# Altium schematic sheet 105358-3SC001-01-A_IO_BRD.SchDoc: I/O Board
size 420 x 297 mm; DrawnBy: JeSa , KaKa; Organization: Hotswap Norden AB; Address1: Knarrarnäsgatan 7; Address2: SE-164 40 Kista; Address3: Sweden; DocumentNumber: 105358-3SC001-01; SheetNumber: 5; SheetTotal: 5; PageSetup: Record=PageOptions|CenterHorizontal=True|CenterVertical=True|PrintScale=0.96|XCorrection=1.00|YCorrection=1.00|PrintKind=0|BorderSize=5000000|LeftOffset=0|BottomOffset=0|Orientation=2|PaperLength=1000|PaperWidth=1000|Scale=100|PaperSource=7|PrintQuality=-4|MediaType=1|DitherType=10|PaperKind=A3|PrintScaleMode=1
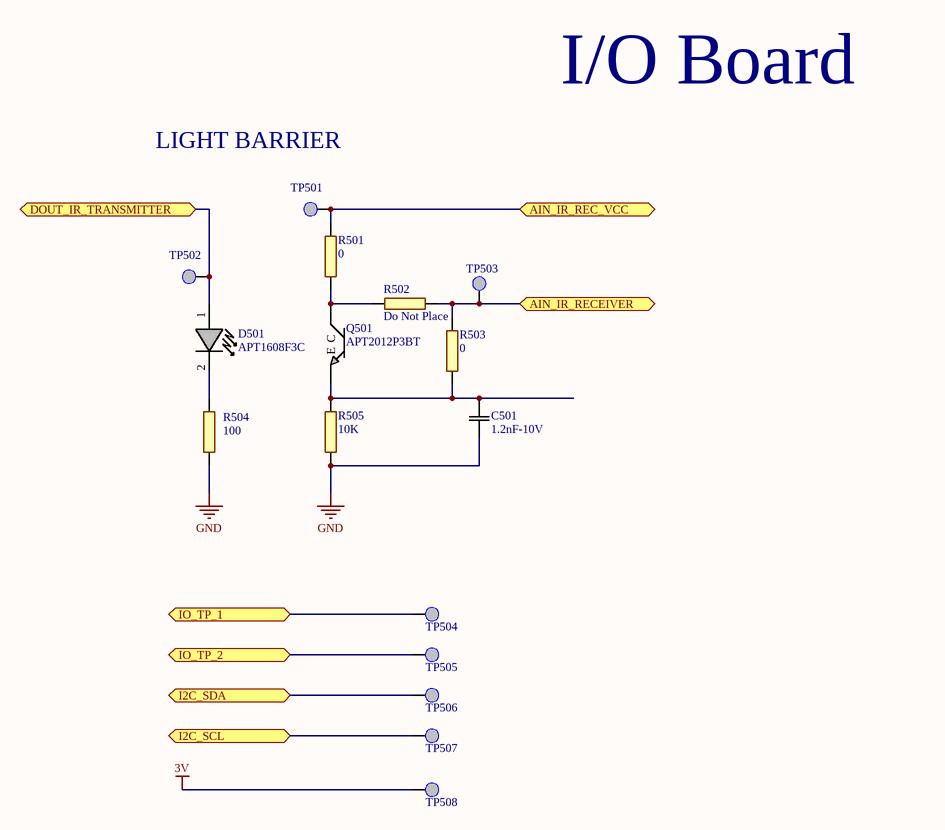
[diagram p0: 105358-3SC001-01-A_IO_BRD.SchDoc]

## Parts
C501  1.2nF-10V  [0402C_HIGH_DENSITY]
D501  APT1608F3C  [APT1608F3C]
Q501  APT2012P3BT  [APT2012P3BT]
R501  0  [0402R-GENERIC]
R502  Do Not Place  [0402R-GENERIC]
R503  0  [0402R-GENERIC]
R504  100  [0402R-GENERIC]
R505  10K  [0402R-GENERIC]
TP501  TEST POINT  [PAD TEST POINT]  (value not drawn)  (no BOM)
TP502  TEST POINT  [PAD TEST POINT]  (value not drawn)  (no BOM)
TP503  TEST POINT  [PAD TEST POINT]  (value not drawn)  (no BOM)
TP504  TEST POINT  [PAD TEST POINT]  (value not drawn)  (no BOM)
TP505  TEST POINT  [PAD TEST POINT]  (value not drawn)  (no BOM)
TP506  TEST POINT  [PAD TEST POINT]  (value not drawn)  (no BOM)
TP507  TEST POINT  [PAD TEST POINT]  (value not drawn)  (no BOM)
TP508  TEST POINT  [PAD TEST POINT]  (value not drawn)  (no BOM)

## Ports
AIN_IR_REC_VCC, AIN_IR_RECEIVER, DOUT_IR_TRANSMITTER, I2C_SCL, I2C_SDA, IO_TP_1, IO_TP_2

## Nets
3V: TP508.1(Test_Point)
GND: C501.1 R504.2 R505.2
AIN_IR_REC_VCC: R501.1 TP501.1(Test_Point) ; port AIN_IR_REC_VCC
AIN_IR_RECEIVER: R502.2 R503.1 TP503.1(Test_Point) ; port AIN_IR_RECEIVER
DOUT_IR_TRANSMITTER: D501.1(A) TP502.1(Test_Point) ; port DOUT_IR_TRANSMITTER
I2C_SCL: TP507.1(Test_Point) ; port I2C_SCL
I2C_SDA: TP506.1(Test_Point) ; port I2C_SDA
IO_TP_1: TP504.1(Test_Point) ; port IO_TP_1
IO_TP_2: TP505.1(Test_Point) ; port IO_TP_2
NetC501_2: C501.2 Q501.1(E) R503.2 R505.1
NetD501_2: D501.2(K) R504.1
NetQ501_2: Q501.2(C) R501.2 R502.1

## Notes on the sheet
- I/O Board
- LIGHT BARRIER
- Title
- Customer, project
- Drawn By
- Board
- Size
- Document Number
- Sheet
- of
- Last modified
- Rev
- Build
- A3

## Library data of the parts
C501 = 0402C-1.2nF-10V: 1.2nF ±10% 10V U2J Ceramic Capacitor 0402; Manufacturer Part Number: GRM1557U1A122JA01D; Manufacturer: Murata Electronics North America; Tolerance: 5%; Capacitance: 1.2nF; Digi-Key Part Number: 490-6272-1-ND; PackageReference: 0402; Temperature Coefficient: U2J; Voltage - Rated: 10V
D501 = APT1608F3C: 0603 INFRARED DIODE; Manufacturer: Kingbright; Wavelength: 940nm; Type: Infrared (IR); Current - DC Forward (If) (Max): 50mA; Radiant Intensity (Ie) Min @ If: 1.2mW/sr @ 20mA; Voltage - Forward (Vf) (Typ): 1.2V; Viewing Angle: 120°; Supplier 1: Digi-Key; Supplier Part Number 1: 754-1433-1-ND; Manufacturer Part Number: APT1608F3C; PackageReference: 0603; Mounting Type: Surface Mount; Operating Temperature: -40°C ~ 85°C (TA); ComponentLink1Description: Datasheet; ComponentLink1URL: http://www.kingbrightusa.com/images/catalog/SPEC/APT1608F3C.pdf; Digi-Key Part Number: 754-1433-1-ND
Q501 = APT2012P3BT: 0805 PHOTOTRANSISTOR; Manufacturer: Kingbright; Voltage - Collector Emitter Breakdown (Max): 30V; Current - Collector (Ic) (Max): 1mA; Current - Dark (Id) (Max): 100nA; Power - Max: 100mW; Supplier 1: Digi-Key; Supplier Part Number 1: 754-1436-1-ND; ComponentLink1Description: Datasheet; ComponentLink1URL: https://www.kingbrightusa.com/images/catalog/spec/APT2012P3BT.pdf; Manufacturer Part Number: APT2012P3BT; PackageReference: 0805; Digi-Key Part Number: 754-1436-1-ND
R501 R503 = 0402R-0 OHM-0.063W: RES SMD 0.0OHM JUMPER 1/16W 0402; Manufacturer: Yageo; Manufacturer Part Number: RC0402JR-070RL; Resistance (Ohms): 0 Ohm; Power: 0.063W; GENERIC_OK: YES; Digi-Key Part Number: 311-0.0JRCT-ND; PackageReference: 0402; Features: Moisture Resistant
R502 = 0402R-Do Not Place
R504 = 0402R-100 OHM-1%-0.063W: RES SMD 100OHM 1% 1/16W 0402; Manufacturer: Yageo; Manufacturer Part Number: RC0402FR-07100RL; Power: 0.063W; GENERIC_OK: YES; Digi-Key Part Number: 311-100LRCT-ND; Resistance (Ohms): 100Ohm; Tolerance: 1%; PackageReference: 0402; Features: Moisture Resistant
R505 = 0402R-10k OHM-1%-0.063W: RES SMD 10kOHM 1% 1/16W 0402; Manufacturer: Yageo; Manufacturer Part Number: RC0402FR-0710KL; Power: 0.063W; GENERIC_OK: YES; Digi-Key Part Number: 311-10.0KLRCT-ND; Resistance (Ohms): 10KOhm; Tolerance: 1%; PackageReference: 0402; Features: Moisture Resistant
TP501-TP508 = TEST POINT: Testing Poiny